# Altium schematic sheet GMSL_SERIALIZER.SchDoc
size C; SheetNumber: 7; SheetTotal: 10
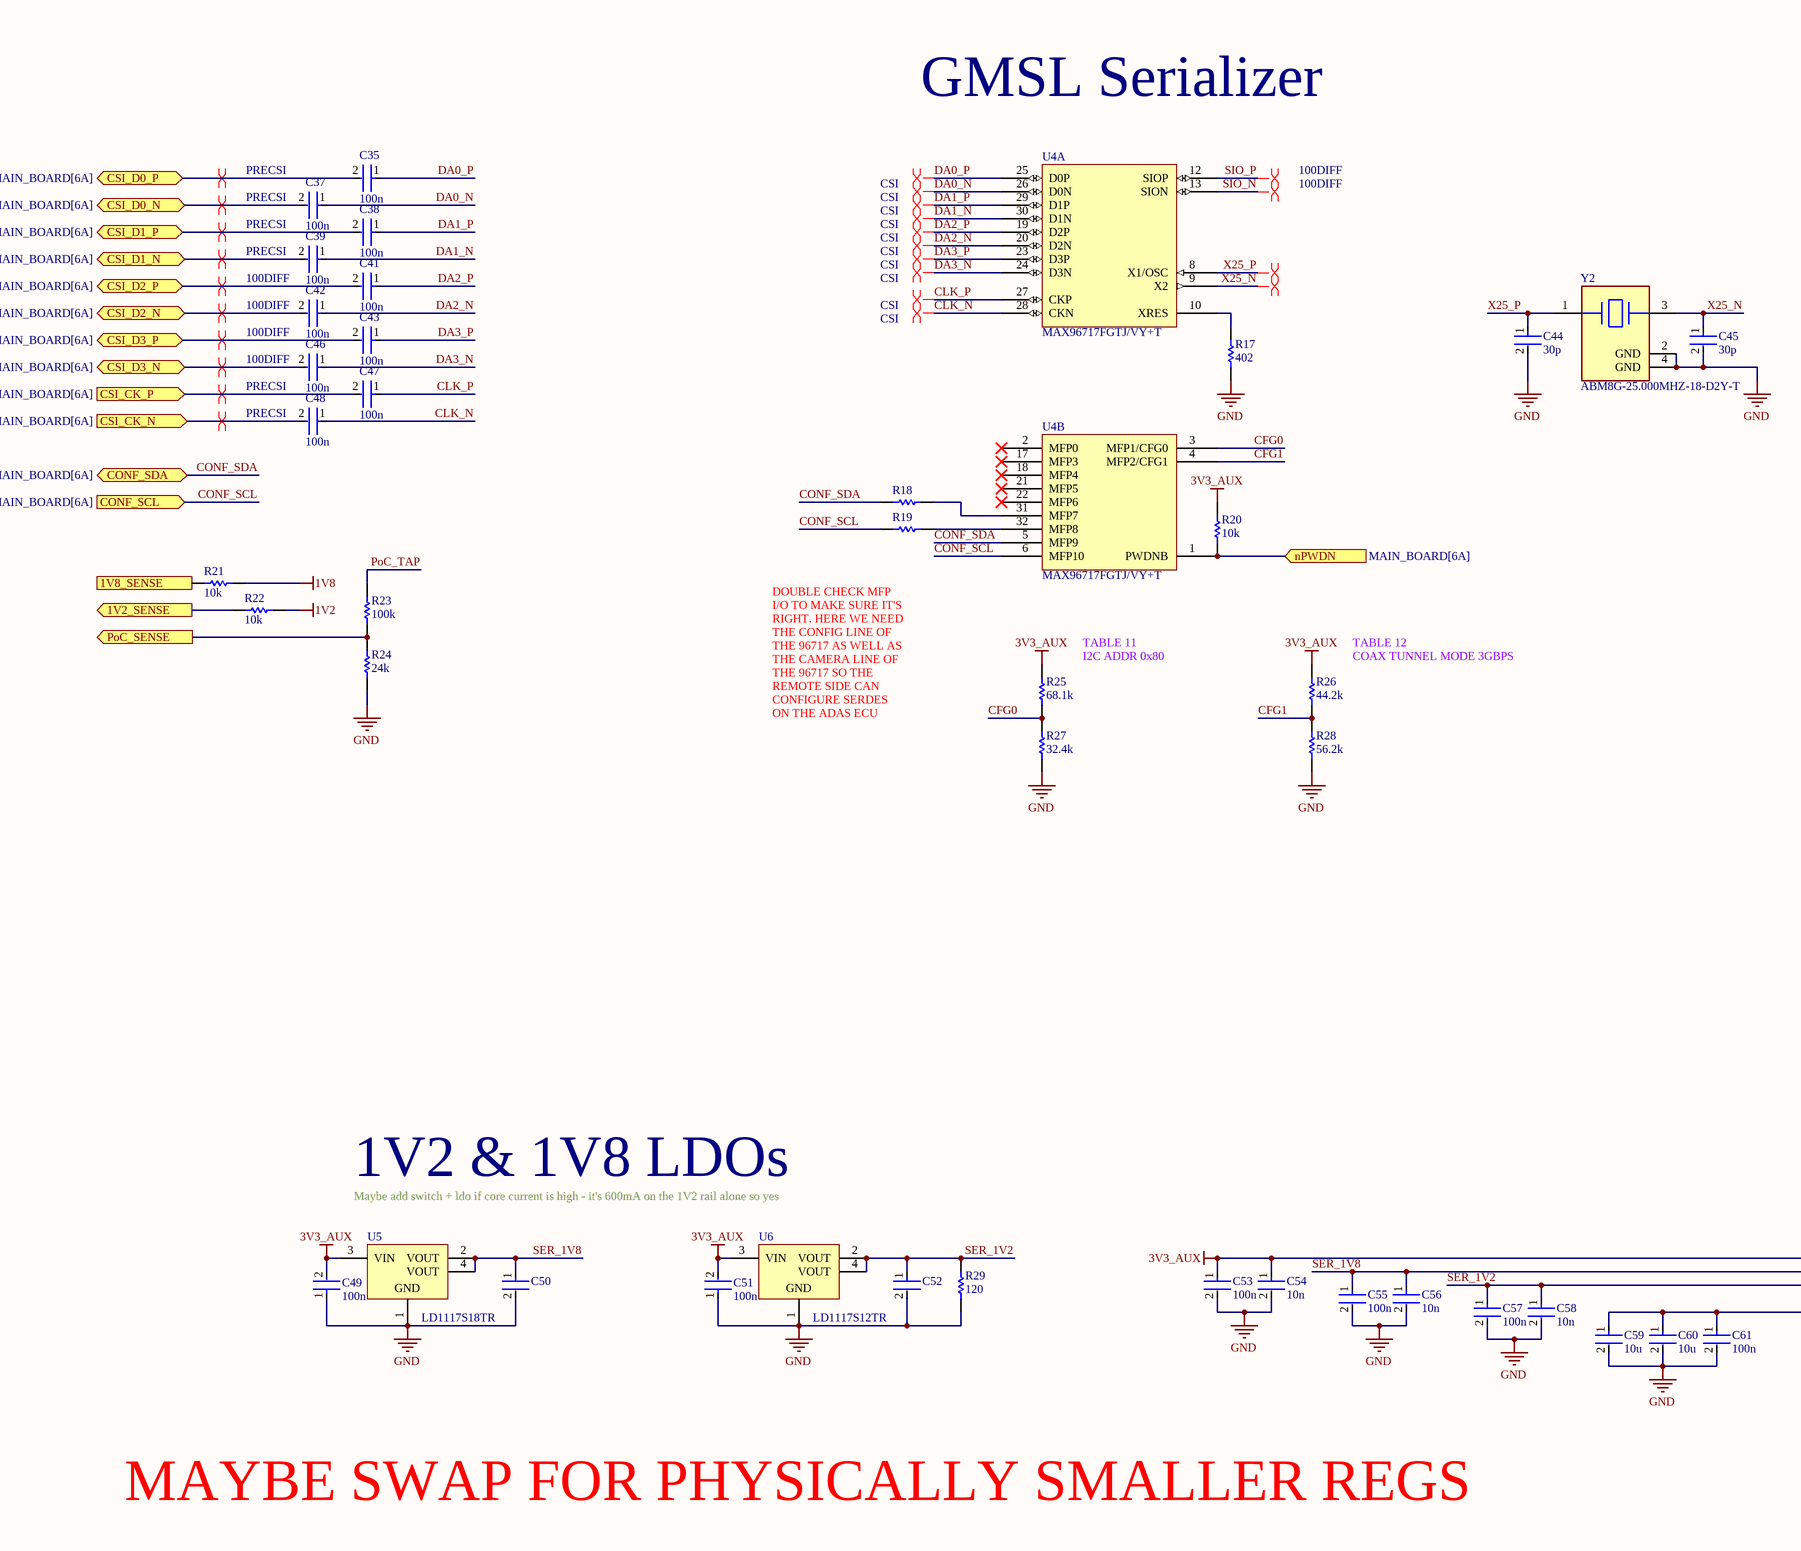
[diagram p0: GMSL_SERIALIZER.SchDoc, left]
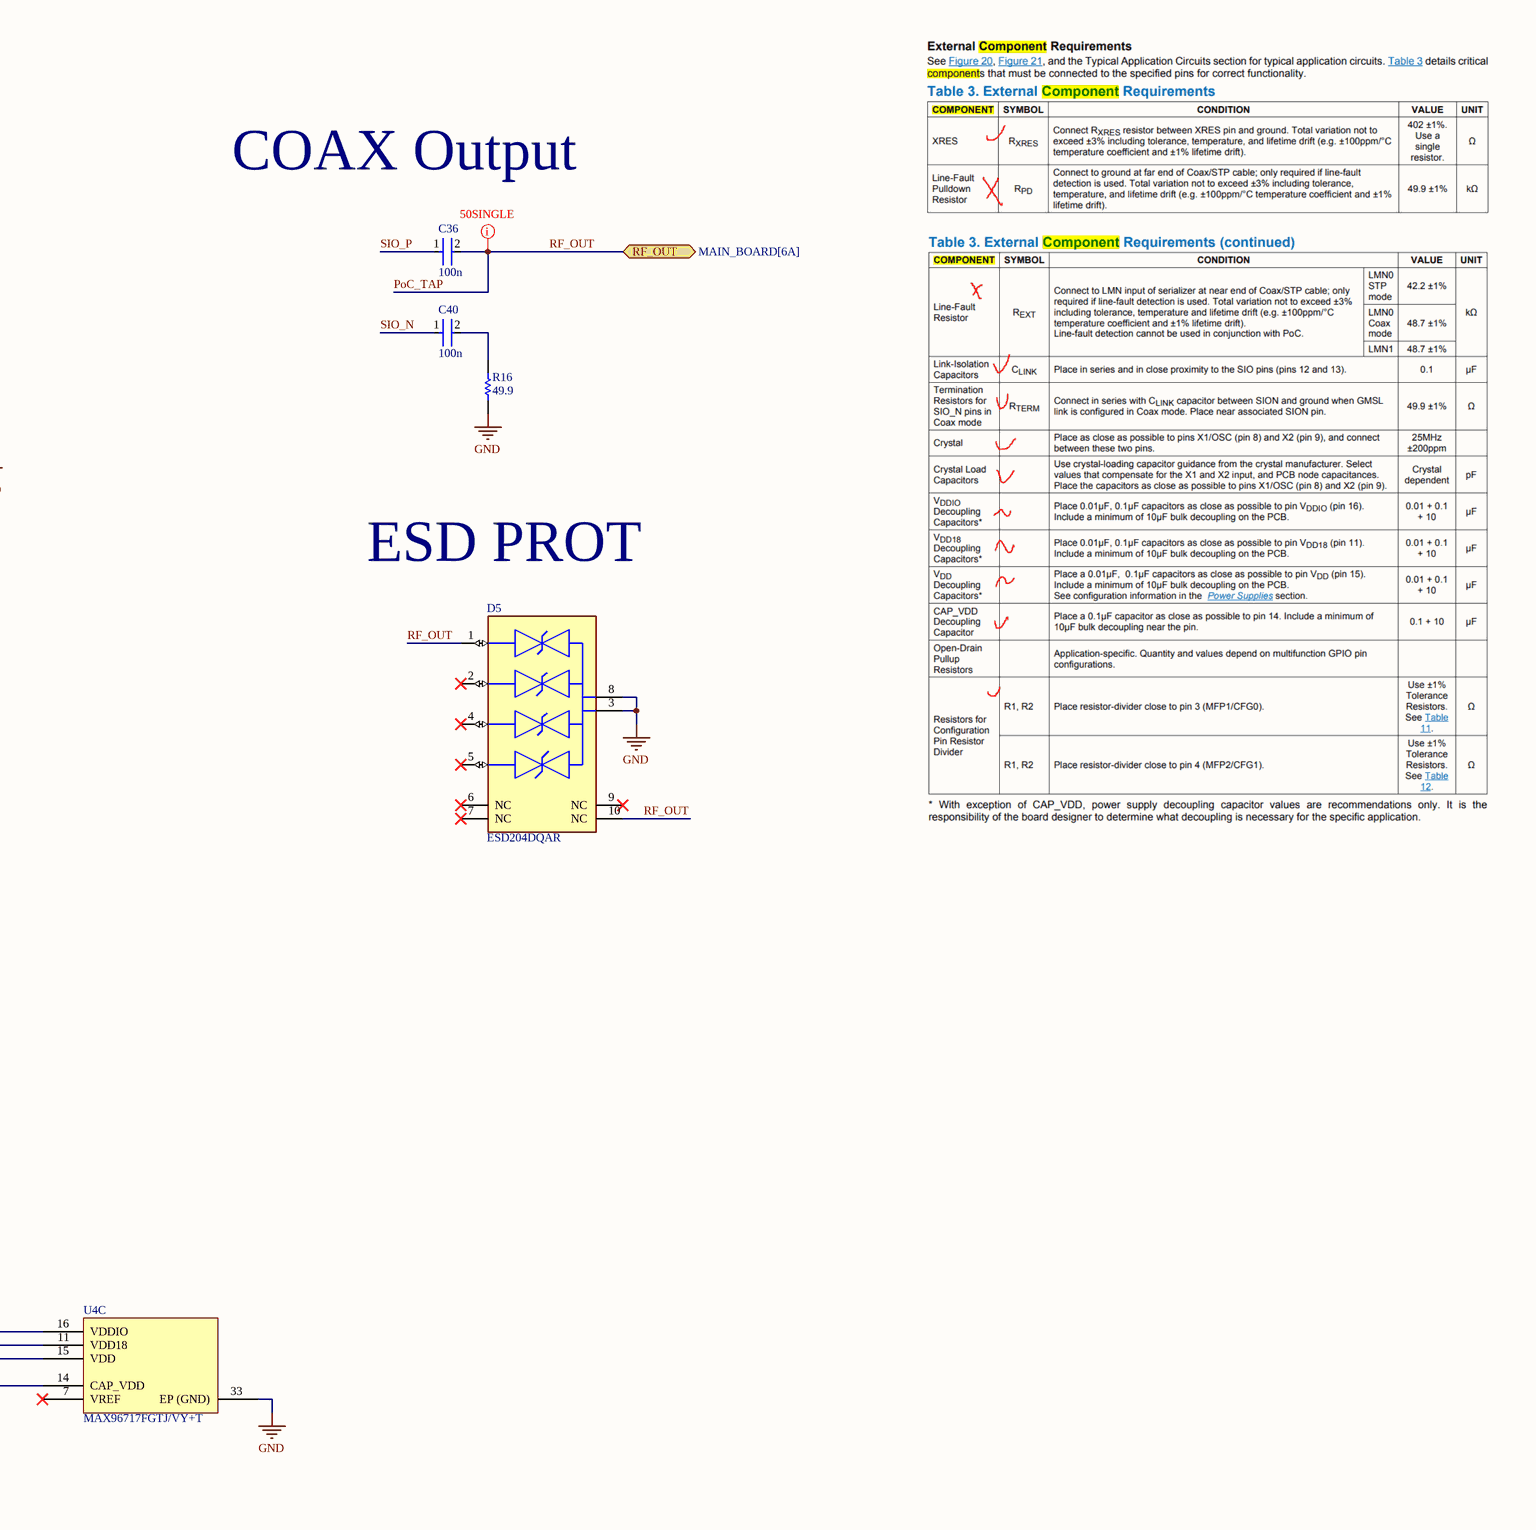
[diagram p1: GMSL_SERIALIZER.SchDoc, right]

## Parts
C35  100n  [FP-0402-L_1_0_0_05-W_0_5-IPC_A]
C36  100n  [FP-0402-L_1_0_0_05-W_0_5-IPC_A]
C37  100n  [FP-0402-L_1_0_0_05-W_0_5-IPC_A]
C38  100n  [FP-0402-L_1_0_0_05-W_0_5-IPC_A]
C39  100n  [FP-0402-L_1_0_0_05-W_0_5-IPC_A]
C40  100n  [FP-0402-L_1_0_0_05-W_0_5-IPC_A]
C41  100n  [FP-0402-L_1_0_0_05-W_0_5-IPC_A]
C42  100n  [FP-0402-L_1_0_0_05-W_0_5-IPC_A]
C43  100n  [FP-0402-L_1_0_0_05-W_0_5-IPC_A]
C44  30p  [FP-0402-L_1_0_0_05-W_0_5-IPC_A]
C45  30p  [FP-0402-L_1_0_0_05-W_0_5-IPC_A]
C46  100n  [FP-0402-L_1_0_0_05-W_0_5-IPC_A]
C47  100n  [FP-0402-L_1_0_0_05-W_0_5-IPC_A]
C48  100n  [FP-0402-L_1_0_0_05-W_0_5-IPC_A]
C49  100n  [FP-0402-L_1_0_0_05-W_0_5-IPC_A]
C50  GRM188R60J106ME47D  [FP-GRM188-0_1-e0_2_0_55-IPC_A]  (value not drawn)
C51  100n  [FP-0402-L_1_0_0_05-W_0_5-IPC_A]
C52  GRM188R60J106ME47D  [FP-GRM188-0_1-e0_2_0_55-IPC_A]  (value not drawn)
C53  100n  [FP-0402-L_1_0_0_05-W_0_5-IPC_A]
C54  10n  [FP-0402-L_1_0_0_05-W_0_5-IPC_A]
C55  100n  [FP-0402-L_1_0_0_05-W_0_5-IPC_A]
C56  10n  [FP-0402-L_1_0_0_05-W_0_5-IPC_A]
C57  100n  [FP-0402-L_1_0_0_05-W_0_5-IPC_A]
C58  10n  [FP-0402-L_1_0_0_05-W_0_5-IPC_A]
C59  10u  [FP-0402-L_1_0_0_05-W_0_5-IPC_A]
C60  10u  [FP-0402-L_1_0_0_05-W_0_5-IPC_A]
C61  100n  [FP-0402-L_1_0_0_05-W_0_5-IPC_A]
D5  ESD204DQAR  [FP-DQA0010A-MFG]
R16  49.9  [R0603B]
R17  402  [R0603B]
R18  0402 JUMPER  [RESC1005X40X25ML05T05]  (value not drawn)
R19  0402 JUMPER  [RESC1005X40X25ML05T05]  (value not drawn)
R20  10k  [R0603B]
R21  10k  [R0603B]
R22  10k  [R0603B]
R23  100k  [R0603B]
R24  24k  [R0603B]
R25  68.1k  [R0603B]
R26  44.2k  [R0603B]
R27  32.4k  [R0603B]
R28  56.2k  [R0603B]
R29  120  [R0603B]
U4  MAX96717FGTJ/VY+T  [QFN50P500X500X80_HS-33N]  (parts A,B,C of 3)
U5  LD1117S18TR  [SOT-223_M]
U6  LD1117S12TR  [SOT-223_M]
Y2  ABM8G-25.000MHZ-18-D2Y-T  [FP-ABM8G-MFG]

## Ports
1V2_SENSE (out), 1V8_SENSE (out), CONF_SCL (in, see MAIN_BOARD[6A]), CONF_SDA (bidir, see MAIN_BOARD[6A]), CSI_CK_N (in, see MAIN_BOARD[6A]), CSI_CK_P (in, see MAIN_BOARD[6A]), CSI_D0_N (bidir, see MAIN_BOARD[6A]), CSI_D0_P (bidir, see MAIN_BOARD[6A]), CSI_D1_N (bidir, see MAIN_BOARD[6A]), CSI_D1_P (bidir, see MAIN_BOARD[6A]), CSI_D2_N (bidir, see MAIN_BOARD[6A]), CSI_D2_P (bidir, see MAIN_BOARD[6A]), CSI_D3_N (bidir, see MAIN_BOARD[6A]), CSI_D3_P (bidir, see MAIN_BOARD[6A]), nPWDN (in, see MAIN_BOARD[6A]), PoC_SENSE (out), RF_OUT (bidir, see MAIN_BOARD[6A])

## Nets
1V2: R22.1
1V8: R21.1
3V3_AUX: C49.2 C51.2 C53.1 C54.1 R20.2 R25.2 R26.2 U4.16(VDDIO) U5.3(VIN) U6.3(VIN)
GND: C44.2 C45.2 C49.1 C50.2 C51.1 C52.2 C53.2 C54.2 C55.2 C56.2 C57.2 C58.2 C59.2 C60.2 C61.2 D5.3(GND) D5.8(GND) R16.1 R17.1 R24.1 R27.1 R28.1 R29.1 U4.33(EP_(GND)) U5.1(GND) U6.1(GND) Y2.2(GND) Y2.4(GND)
1V2_SENSE: R22.2 ; port 1V2_SENSE
1V8_SENSE: R21.2 ; port 1V8_SENSE
CFG0: R25.1 R27.2 U4.3(MFP1/CFG0)
CFG1: R26.1 R28.2 U4.4(MFP2/CFG1)
CLK_N: C48.1 U4.28(CKN)
CLK_P: C47.1 U4.27(CKP)
CONF_SCL: R19.1 U4.6(MFP10) ; port CONF_SCL
CONF_SDA: R18.1 U4.5(MFP9) ; port CONF_SDA
CSI_CK_N: C48.2 ; port CSI_CK_N
CSI_CK_P: C47.2 ; port CSI_CK_P
CSI_D0_N: C37.2 ; port CSI_D0_N
CSI_D0_P: C35.2 ; port CSI_D0_P
CSI_D1_N: C39.2 ; port CSI_D1_N
CSI_D1_P: C38.2 ; port CSI_D1_P
CSI_D2_N: C42.2 ; port CSI_D2_N
CSI_D2_P: C41.2 ; port CSI_D2_P
CSI_D3_N: C46.2 ; port CSI_D3_N
CSI_D3_P: C43.2 ; port CSI_D3_P
DA0_N: C37.1 U4.26(D0N)
DA0_P: C35.1 U4.25(D0P)
DA1_N: C39.1 U4.30(D1N)
DA1_P: C38.1 U4.29(D1P)
DA2_N: C42.1 U4.20(D2N)
DA2_P: C41.1 U4.19(D2P)
DA3_N: C46.1 U4.24(D3N)
DA3_P: C43.1 U4.23(D3P)
nPWDN: R20.1 U4.1(PWDNB) ; port nPWDN
PoC_SENSE: R23.1 R24.2 ; port PoC_SENSE
PoC_TAP: C36.2 D5.1(IO1) D5.10(NC) R23.2 ; port RF_OUT  [also labelled RF_OUT]
SER_1V2: C52.1 C57.1 C58.1 R29.2 U4.15(VDD) U6.2(VOUT) U6.4(VOUT)
SER_1V8: C50.1 C55.1 C56.1 U4.11(VDD18) U5.2(VOUT) U5.4(VOUT)
SIO_N: C40.1 U4.13(SION)
SIO_P: C36.1 U4.12(SIOP)
X25_N: C45.1 U4.9(X2) Y2.3
X25_P: C44.1 U4.8(X1/OSC) Y2.1
NetC40_2: C40.2 R16.2
NetC59_1: C59.1 C60.1 C61.1 U4.14(CAP_VDD)
NetR17_2: R17.2 U4.10(XRES)
NetR18_2: R18.2 U4.31(MFP7)
NetR19_2: R19.2 U4.32(MFP8)

Not connected (* = marked no-connect by the designer): D5 2(IO2)* 4(IO3)* 5(IO4)* 6(NC)* 7(NC)* 9(NC)*; U4 2(MFP0)* 7(VREF)* 17(MFP3)* 18(MFP4)* 21(MFP5)* 22(MFP6)*

## Layout directives
differential pair: X25_N, X25_P
differential pair; differential pair class CSI: CLK_N, CLK_P, DA0_N, DA0_P, DA1_N, DA1_P, DA2_N, DA2_P, DA3_N, DA3_P
differential pair; differential pair class 100DIFF: CSI_D2_N, CSI_D2_P, CSI_D3_N, CSI_D3_P, SIO_N, SIO_P
differential pair; differential pair class PRECSI: CSI_CK_N, CSI_CK_P, CSI_D0_N, CSI_D0_P, CSI_D1_N, CSI_D1_P
net class 50SINGLE: PoC_TAP

## Notes on the sheet
- GMSL Serializer
- COAX Output
- ESD PROT
- (near R25) I2C ADDR 0x80
- (near R25) TABLE 11
- (near R26) COAX TUNNEL MODE 3GBPS
- (near R26) TABLE 12
- DOUBLE CHECK MFP I/O TO MAKE SURE IT'S RIGHT. HERE WE NEED THE CONFIG LINE OF THE 96717 AS WELL AS THE CAMERA LINE OF THE 96717 SO THE REMOTE SIDE CAN CONFIGURE SERDES ON THE ADAS ECU
- 1V2 & 1V8 LDOs
- Maybe add switch + ldo if core current is high - it's 600mA on the 1V2 rail alone so yes
- MAYBE SWAP FOR PHYSICALLY SMALLER REGS

## Library data of the parts
C35-C49 C51 C53-C61 = CMP-001-00058-1: LARGE PADS, 0402 CAP, CHANGE COMMENT TO MATCH REAL P/N; Capacitor Type: Ceramic; Min Operating Temperature: -55°C; Mounting Technology: Surface Mount; Pins: 2; Case/Package: 0402; RoHS Compliant: Yes; Max Operating Temperature: 85°C
C50 C52 = CMP-2006-02792-2: Chip Multilayer Ceramic Capacitors for General Purpose, 0603, 10uF, X5R, 15%, 20%, 6.3V; Packaging: Tape and Reel; Voltage Rating (DC): 6.3V; Width: 0.031inch; Termination: SMD/SMT; Dielectric: X5R; Package Quantity: 4000; Voltage Rating: 6.3V; Capacitance: 10uF; Case/Package: 0603; Min Operating Temperature: -55°C; Voltage: 6.3V; Length: 1.6mm; Thickness: 0.035inch; Lead Free: Lead Free; Depth: 0.8mm; Case Code (Imperial): 0603; Max Operating Temperature: 85°C; Material: Ceramic; Height: 0.8mm; Tolerance: 20%; Mount: Surface Mount; REACH SVHC: No SVHC; Radiation Hardening: No; Case Code (Metric): 1608
D5 = CMP-04989-000002-1: 4-CHANNEL LOW-CAPACITANCE SURGE; Manufacturer: Texas Instruments; Value: 0.55pF; Reverse Standoff Voltage: 3.6V; Standoff Height: 0mm; Breakdown Voltage: 5.5V; Peak Pulse Current: 5.5A; Clamping Voltage: 11.5V; Direction: Bidirectional; Peak Pulse Power: 50W; Number Of Channels: 4; Ambient Temperature Range High: +125°C; ComponentLink2Description: Datasheet; Height: 0.55mm; Lead Free: Yes; Device Class L3: unset; Temperature Range High: +125°C; Temperature Range Low: -40°C; Package: DQA0010A; Temperature: -40°C to +125°C; Capacitance: 0.55pF; RoHS: TRUE; Mouser Description: 4-Channel Low-Capacitance Surge and ESD Protection Diode 10-USON -40 to 125; Category: Diode; Device Class L1: Circuit Protection; Octopart: https://octopart.com/esd204dqar-texas+instruments-89917476; Device Class L2: TVS Diodes; Ambient Temperature Range Low: -40°C; Manufacturer Part Number: ESD204DQAR; ComponentLink2URL: http://www.ti.com/lit/ds/symlink/esd204.pdf; Automotive: No; Digikey Description: 4-CHANNEL LOW-CAPACITANCE SURGE
R16 R17 R20-R29 = CMP-009-00002-14: Resistor
R18 R19 = CMP-009-00118-2: READ THE NAME; Pins: 2; Component Type: Standard; Design Item ID: CMP-009-00206-2; Source: 0402jump.SchLib
U4 = CMP-015-00012-1: 3Gbps Serializer TQFN-32 Serializers / Deserializers ROHS
U5 = CMP-0244-00308-1: Fixed Low Drop Positive Voltage Regulator, 1.8V, 4-Pin SOT-223, Tape and Reel; ComponentLink1URL: http://www.st.com; PackageReference: SOT-223; PackageDescription: 4-Pin SOT-223 Package, 6.5 x 3.5 mm Body, 2.3 mm Pitch, 7 mm Lead Span; ComponentLink2URL: http://www.st.com/internet/com/TECHNICAL_RESOURCES/TECHNICAL_LITERATURE/DATASHEET/CD00000544.pdf; ComponentLink2Description: Datasheet; ComponentLink1Description: Manufacturer URL; DatasheetVersion: 1/11/2011; PackageVersion: 2010
U6 = CMP-0244-00318-1: Fixed Low Drop Positive Voltage Regulator, 1.2V, 4-Pin SOT-223, Tape and Reel; PackageDescription: 4-Pin SOT-223 Package, 6.5 x 3.5 mm Body, 2.3 mm Pitch, 7 mm Lead Span; PackageVersion: 2010; ComponentLink2Description: Datasheet; PackageReference: SOT-223; ComponentLink2URL: http://www.st.com/internet/com/TECHNICAL_RESOURCES/TECHNICAL_LITERATURE/DATASHEET/CD00000544.pdf; ComponentLink1Description: Manufacturer URL; DatasheetVersion: 1/11/2011; ComponentLink1URL: http://www.st.com
Y2 = CMP-2000-05733-3: Crystal 25MHz ±20ppm (Tol) ±30ppm (Stability) 18pF FUND 60Ω 4-Pin SMD T/R; Series Resistance: 60R; Length: 3.2mm; Depth: 2.5mm; Packaging: Tape and Reel; Min Operating Temperature: -40°C; Operating Frequency: 25 MHz; Lead Free: Lead Free; Number of Pins: 4; Frequency Tolerance: 20ppm; Radiation Hardening: No; Max Operating Temperature: 85°C; Termination: SMD/SMT; Frequency Stability: 30ppm; Frequency: 25MHz; Series: ABM8G; Mount: Surface Mount; Package Quantity: 1000; Height: 0.039inch; Width: 0.098inch; Case/Package: CSMD; ESR (Equivalent Series Resistance): 60R; Load Capacitance: 18pF; Tolerance: 20ppm